# Altium project Ballast and Depth Controller.PrjPcb
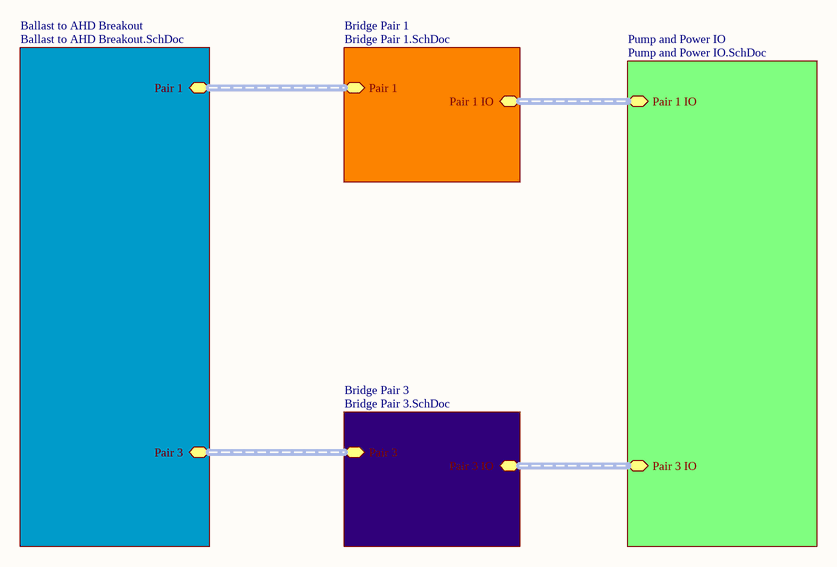
[diagram p0: Ballast and Depth Controller.SchDoc]
5 sheets, 103 parts. Net scope: hierarchical (ports join the sheet entries above them; power ports are global).
Board file: Ballast and Depth Controller.PcbDoc
Sheets:
  Ballast and Depth Controller.SchDoc
    Ballast to AHD Breakout = Ballast to AHD Breakout.SchDoc
    Bridge Pair 1 = Bridge Pair 1.SchDoc
    Pump and Power IO = Pump and Power IO.SchDoc
    Bridge Pair 3 = Bridge Pair 3.SchDoc

## Sheet Ballast and Depth Controller.SchDoc: Active Ballast Controller
size A; DrawnBy: Adam Vadala-Roth; DocumentNumber: 1; Revision: 2.1a; SheetNumber: 1; SheetTotal: 5

### Sub-sheets
Ballast to AHD Breakout = Ballast to AHD Breakout.SchDoc: Pair 1 (harness Pair_1_AHD), Pair 3 (harness Pair_3_AHD)
Bridge Pair 1 = Bridge Pair 1.SchDoc: Pair 1 (harness Pair_1_AHD), Pair 1 IO (harness Pair_1_IO)
Bridge Pair 3 = Bridge Pair 3.SchDoc: Pair 3 (harness Pair_3_AHD), Pair 3 IO (harness Pair_3_IO)
Pump and Power IO = Pump and Power IO.SchDoc: Pair 1 IO (harness Pair_1_IO), Pair 3 IO (harness Pair_3_IO)

### Buses and harness runs
harness sheet Ballast to AHD Breakout/Pair 1 = sheet Bridge Pair 1/Pair 1
harness sheet Ballast to AHD Breakout/Pair 3 = sheet Bridge Pair 3/Pair 3
harness sheet Bridge Pair 1/Pair 1 IO = sheet Pump and Power IO/Pair 1 IO
harness sheet Bridge Pair 3/Pair 3 IO = sheet Pump and Power IO/Pair 3 IO

## Sheet Ballast to AHD Breakout.SchDoc: Control Signal Breakout & Current Sesnsing
size A; DrawnBy: Adam Vadala-Roth; DocumentNumber: 2; Revision: 2.1a; SheetNumber: 2; SheetTotal: 5
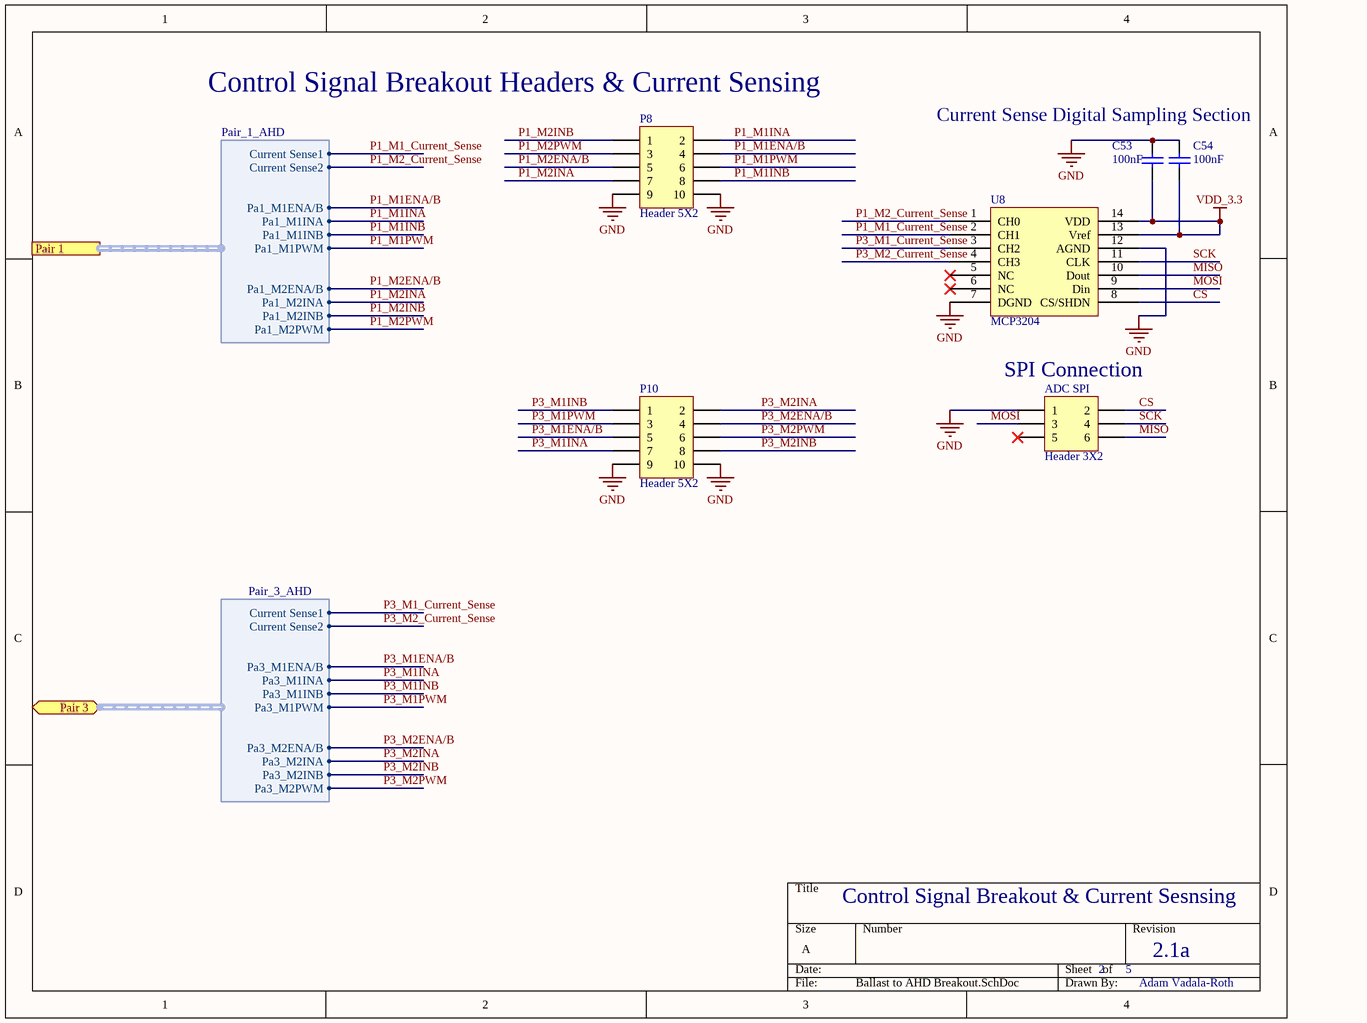
[diagram p1: Ballast to AHD Breakout.SchDoc]

### Parts
ADC_SPI  Header 3X2  [HDR2X3]
C53  value 100nF  [C1206]  (hidden comment: Cap Semi)
C54  value 100nF  [C1206]  (hidden comment: Cap Semi)
P8  Header 5X2  [HDR2X5]
P10  Header 5X2  [HDR2X5]
U8  MCP3204  [MCP3204]

### Ports
Pair 1 (harness Pair_1_AHD), Pair 3 (harness Pair_3_AHD)

### Harnesses
Pair_1_AHD: Current Sense1, Current Sense2, Pa1_M1ENA/B, Pa1_M1INA, Pa1_M1INB, Pa1_M1PWM, Pa1_M2INA, Pa1_M2ENA/B, Pa1_M2INB, Pa1_M2PWM
Pair_3_AHD: Current Sense1, Current Sense2, Pa3_M1ENA/B, Pa3_M1INA, Pa3_M1INB, Pa3_M1PWM, Pa3_M2INA, Pa3_M2ENA/B, Pa3_M2INB, Pa3_M2PWM

### Nets
GND: ADC_SPI.1 C53.2 C54.2 P8.9 P8.10 P10.9 P10.10 U8.7(DGND) U8.12(AGND)
VDD_3.3: C53.1 C54.1 U8.13(Vref) U8.14(VDD)
CS: ADC_SPI.2 U8.8(CS/SHDN)
MISO: ADC_SPI.6 U8.10(Dout)
MOSI: ADC_SPI.3 U8.9(Din)
P1_M1_Current_Sense: U8.2(CH1) ; port Pair 1.Current Sense1
P1_M1ENA/B: P8.4 ; port Pair 1.Pa1_M1ENA/B
P1_M1INA: P8.2 ; port Pair 1.Pa1_M1INA
P1_M1INB: P8.8 ; port Pair 1.Pa1_M1INB
P1_M1PWM: P8.6 ; port Pair 1.Pa1_M1PWM
P1_M2_Current_Sense: U8.1(CH0) ; port Pair 1.Current Sense2
P1_M2ENA/B: P8.5 ; port Pair 1.Pa1_M2ENA/B
P1_M2INA: P8.7 ; port Pair 1.Pa1_M2INA
P1_M2INB: P8.1 ; port Pair 1.Pa1_M2INB
P1_M2PWM: P8.3 ; port Pair 1.Pa1_M2PWM
P3_M1_Current_Sense: U8.3(CH2) ; port Pair 3.Current Sense1
P3_M1ENA/B: P10.5 ; port Pair 3.Pa3_M1ENA/B
P3_M1INA: P10.7 ; port Pair 3.Pa3_M1INA
P3_M1INB: P10.1 ; port Pair 3.Pa3_M1INB
P3_M1PWM: P10.3 ; port Pair 3.Pa3_M1PWM
P3_M2_Current_Sense: U8.4(CH3) ; port Pair 3.Current Sense2
P3_M2ENA/B: P10.4 ; port Pair 3.Pa3_M2ENA/B
P3_M2INA: P10.2 ; port Pair 3.Pa3_M2INA
P3_M2INB: P10.8 ; port Pair 3.Pa3_M2INB
P3_M2PWM: P10.6 ; port Pair 3.Pa3_M2PWM
SCK: ADC_SPI.4 U8.11(CLK)

Not connected (* = marked no-connect by the designer): ADC_SPI 5*; U8 5(NC)* 6(NC)*

### Notes on the sheet
- (near P8) Control Signal Breakout Headers & Current Sensing
- Current Sense Digital Sampling Section
- (near ADC_SPI) SPI Connection

### Library data of the parts
ADC_SPI = Header 3X2: Header, 3-Pin, Dual row; LatestRevisionDate: 17-Jul-2002; LatestRevisionNote: Re-released for DXP Platform.; Publisher: Altium Limited
C53 C54 = Cap Semi: Capacitor (Semiconductor SIM Model); Published: 8-Jun-2000; LatestRevisionDate: 29-May-2009; LatestRevisionNote: IPC-7351 Footprint Added.; PackageReference: C1206; Publisher: Altium Limited; PackageDescription: Chip Capacitor
P8 P10 = Header 5X2: Header, 5-Pin, Dual row; LatestRevisionDate: 17-Jul-2002; LatestRevisionNote: Re-released for DXP Platform.; Publisher: Altium Limited
U8 = MCP3204: MCP3204 ADC

## Sheet Bridge Pair 1.SchDoc: VNH5019 Pair 1
size B; DrawnBy: Adam Vadala-Roth; DocumentNumber: 5; Revision: 2.1a; SheetNumber: 5; SheetTotal: 5
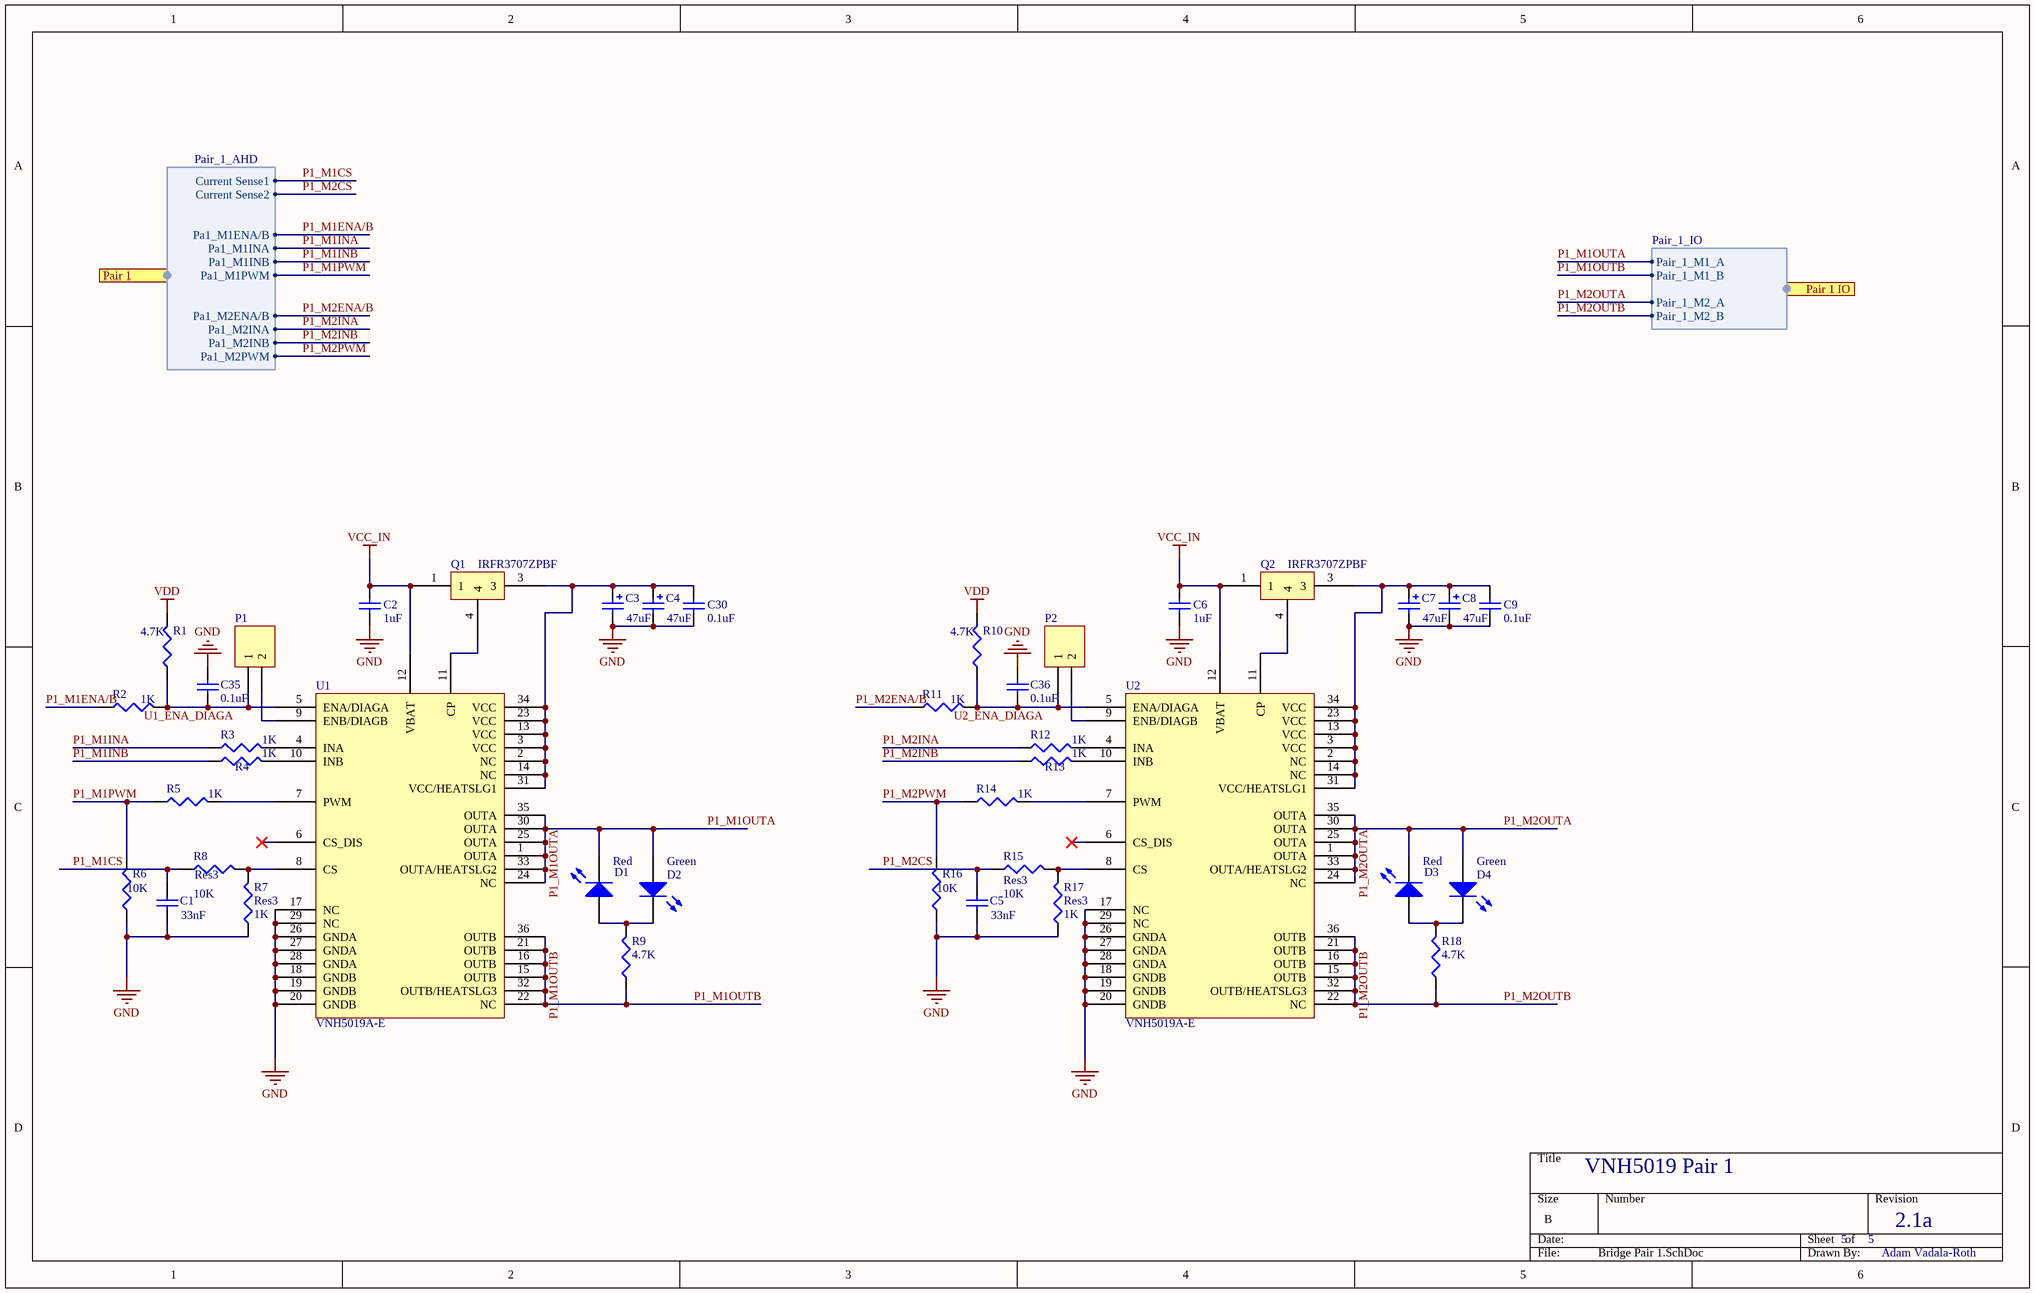
[diagram p2: Bridge Pair 1.SchDoc]

### Parts
C1  value 33nF  [1608[0603]]  (hidden comment: Cap Semi)
C2  value 1uF  [1608[0603]]  (hidden comment: Cap Semi)
C3  value 47uF  [CAPPR2-5x6.8]  (hidden comment: Cap Pol2)
C4  value 47uF  [CAPPR2-5x6.8]  (hidden comment: Cap Pol2)
C5  value 33nF  [1608[0603]]  (hidden comment: Cap Semi)
C6  value 1uF  [1608[0603]]  (hidden comment: Cap Semi)
C7  value 47uF  [CAPPR2-5x6.8]  (hidden comment: Cap Pol2)
C8  value 47uF  [CAPPR2-5x6.8]  (hidden comment: Cap Pol2)
C9  value 0.1uF  [C1206]  (hidden comment: Cap Semi)
C30  value 0.1uF  [C1206]  (hidden comment: Cap Semi)
C35  value 0.1uF  [1608[0603]]  (hidden comment: Cap Semi)
C36  value 0.1uF  [1608[0603]]  (hidden comment: Cap Semi)
D1  LED2  [3.2X1.6X1.1]  (value not drawn)
D2  LED2  [3.2X1.6X1.1]  (value not drawn)
D3  LED2  [3.2X1.6X1.1]  (value not drawn)
D4  LED2  [3.2X1.6X1.1]  (value not drawn)
P1  Header 2  [HDR1X2]  (value not drawn)
P2  Header 2  [HDR1X2]  (value not drawn)
Q1  IRFR3707ZPBF  [IRFR3707ZPBF]
Q2  IRFR3707ZPBF  [IRFR3707ZPBF]
R1  value 4.7K  [RESC1608L]  (hidden comment: Res3)
R2  value 1K  [RESC1608L]  (hidden comment: Res3)
R3  value 1K  [RESC1608L]  (hidden comment: Res3)
R4  value 1K  [RESC1608L]  (hidden comment: Res3)
R5  value 1K  [RESC1608L]  (hidden comment: Res3)
R6  value 10K  [RESC1608L]  (hidden comment: Res3)
R7  Res3  value 1K  [RESC1608L]
R8  Res3  value 10K  [RESC1608L]
R9  value 4.7K  [0805 SMD Resistor]  (hidden comment: Res3)
R10  value 4.7K  [RESC1608L]  (hidden comment: Res3)
R11  value 1K  [RESC1608L]  (hidden comment: Res3)
R12  value 1K  [RESC1608L]  (hidden comment: Res3)
R13  value 1K  [RESC1608L]  (hidden comment: Res3)
R14  value 1K  [RESC1608L]  (hidden comment: Res3)
R15  Res3  value 10K  [RESC1608L]
R16  value 10K  [RESC1608L]  (hidden comment: Res3)
R17  Res3  value 1K  [RESC1608L]
R18  value 4.7K  [0805 SMD Resistor]  (hidden comment: Res3)
U1  VNH5019A-E  [VNH5019A-E]
U2  VNH5019A-E  [VNH5019A-E]

### Ports
Pair 1 (harness Pair_1_AHD), Pair 1 IO (harness Pair_1_IO)

### Harnesses
Pair_1_IO: Pair_1_M1_A, Pair_1_M1_B, Pair_1_M2_A, Pair_1_M2_B
Pair_1_AHD: Current Sense1, Current Sense2, Pa1_M1ENA/B, Pa1_M1INA, Pa1_M1INB, Pa1_M1PWM, Pa1_M2INA, Pa1_M2ENA/B, Pa1_M2INB, Pa1_M2PWM

### Nets
GND: C1.1 C2.1 C3.2 C4.2 C5.1 C6.1 C7.2 C8.2 C9.1 C30.1 C35.1 C36.1 R6.1 R7.1 R16.1 R17.1 U1.17(NC) U1.18(GNDB) U1.19(GNDB) U1.20(GNDB) U1.26(GNDA) U1.27(GNDA) U1.28(GNDA) U1.29(NC) U2.17(NC) U2.18(GNDB) U2.19(GNDB) U2.20(GNDB) U2.26(GNDA) U2.27(GNDA) U2.28(GNDA) U2.29(NC)
VCC_IN: C2.2 C6.2 Q1.1 Q2.1 U1.12(VBAT) U2.12(VBAT)
VDD: R1.2 R10.2
P1_M1CS: C1.2 R8.1 ; port Pair 1.Current Sense1  [project net P1_M1_Current_Sense]
P1_M1ENA/B: R2.1 ; port Pair 1.Pa1_M1ENA/B
P1_M1INA: R3.1 ; port Pair 1.Pa1_M1INA
P1_M1INB: R4.1 ; port Pair 1.Pa1_M1INB
P1_M1OUTA: D1.2(K) D2.1(A) U1.1(OUTA) U1.24(NC) U1.25(OUTA) U1.30(OUTA) U1.33(OUTA/HEATSLG2) U1.35(OUTA) ; port Pair 1 IO.Pair_1_M1_A
P1_M1OUTB: R9.1 U1.15(OUTB) U1.16(OUTB) U1.21(OUTB) U1.22(NC) U1.32(OUTB/HEATSLG3) U1.36(OUTB) ; port Pair 1 IO.Pair_1_M1_B
P1_M1PWM: R5.1 R6.2 ; port Pair 1.Pa1_M1PWM
P1_M2CS: C5.2 R15.1 ; port Pair 1.Current Sense2  [project net P1_M2_Current_Sense]
P1_M2ENA/B: R11.1 ; port Pair 1.Pa1_M2ENA/B
P1_M2INA: R12.1 ; port Pair 1.Pa1_M2INA
P1_M2INB: R13.1 ; port Pair 1.Pa1_M2INB
P1_M2OUTA: D3.2(K) D4.1(A) U2.1(OUTA) U2.24(NC) U2.25(OUTA) U2.30(OUTA) U2.33(OUTA/HEATSLG2) U2.35(OUTA) ; port Pair 1 IO.Pair_1_M2_A
P1_M2OUTB: R18.1 U2.15(OUTB) U2.16(OUTB) U2.21(OUTB) U2.22(NC) U2.32(OUTB/HEATSLG3) U2.36(OUTB) ; port Pair 1 IO.Pair_1_M2_B
P1_M2PWM: R14.1 R16.2 ; port Pair 1.Pa1_M2PWM
U1_ENA_DIAGA: C35.2 P1.1 R1.1 R2.2 U1.5(ENA/DIAGA)
U2_ENA_DIAGA: C36.2 P2.1 R10.1 R11.2 U2.5(ENA/DIAGA)
NetC3_1: C3.1 C4.1 C30.2 Q1.3 U1.2(NC) U1.3(VCC) U1.13(VCC) U1.14(NC) U1.23(VCC) U1.31(VCC/HEATSLG1) U1.34(VCC)
NetC7_1: C7.1 C8.1 C9.2 Q2.3 U2.2(NC) U2.3(VCC) U2.13(VCC) U2.14(NC) U2.23(VCC) U2.31(VCC/HEATSLG1) U2.34(VCC)
NetD1_1: D1.1(A) D2.2(K) R9.2
NetD3_1: D3.1(A) D4.2(K) R18.2
NetP1_2: P1.2 U1.9(ENB/DIAGB)
NetP2_2: P2.2 U2.9(ENB/DIAGB)
NetQ1_4: Q1.4 U1.11(CP)
NetQ2_4: Q2.4 U2.11(CP)
NetR3_2: R3.2 U1.4(INA)
NetR4_2: R4.2 U1.10(INB)
NetR5_2: R5.2 U1.7(PWM)
NetR7_2: R7.2 R8.2 U1.8(CS)
NetR12_2: R12.2 U2.4(INA)
NetR13_2: R13.2 U2.10(INB)
NetR14_2: R14.2 U2.7(PWM)
NetR15_2: R15.2 R17.2 U2.8(CS)

Not connected (* = marked no-connect by the designer): U1 6(CS_DIS)*; U2 6(CS_DIS)*

### Notes on the sheet
- Red
- (near D2) Green
- (near D4) Green

### Library data of the parts
C1 C2 C5 C6 C9 C30 C35 C36 = Cap Semi: Capacitor (Semiconductor SIM Model); Published: 8-Jun-2000; LatestRevisionDate: 29-May-2009; LatestRevisionNote: IPC-7351 Footprint Added.; PackageReference: C1206; Publisher: Altium Limited; PackageDescription: Chip Capacitor
C3 C4 C7 C8 = Cap Pol2: Polarized Capacitor (Axial); Published: 8-Jun-2000; LatestRevisionDate: 17-Jul-2002; LatestRevisionNote: Re-released for DXP Platform.; PackageReference: POLAR0.8; Publisher: Altium Limited; PackageDescription: Polarized Capacitor; 2 Leads
D1-D4 = LED2: Typical RED, GREEN, YELLOW, AMBER GaAs LED; Published: 8-Jun-2000; LatestRevisionDate: 17-Jul-2002; LatestRevisionNote: Re-released for DXP Platform.; PackageVersion: Feb-2002; PackageReference: 3.2X1.6X1.1; Publisher: Altium Limited; PackageDescription: SM LED; 2 Flat Leads
P1 P2 = Header 2: Header, 2-Pin; LatestRevisionDate: 17-Jul-2002; LatestRevisionNote: Re-released for DXP Platform.; Publisher: Altium Limited
Q1 Q2 = IRFR3707ZPBF: Power FET
R1-R18 = Res3: Resistor; Published: 8-Jun-2000; LatestRevisionDate: 29-May-2009; LatestRevisionNote: IPC-7351 Footprint Added.; PackageReference: J1-0603; Publisher: Altium Limited; PackageDescription: Chip Resistor
U1 U2 = VNH5019A-E: VNH5019A-E H-Bridge

## Sheet Pump and Power IO.SchDoc: Actuator and Power Connection Terminals
size A; DrawnBy: Adam Vadala-Roth; DocumentNumber: 3; Revision: 2.1a; SheetNumber: 3; SheetTotal: 5
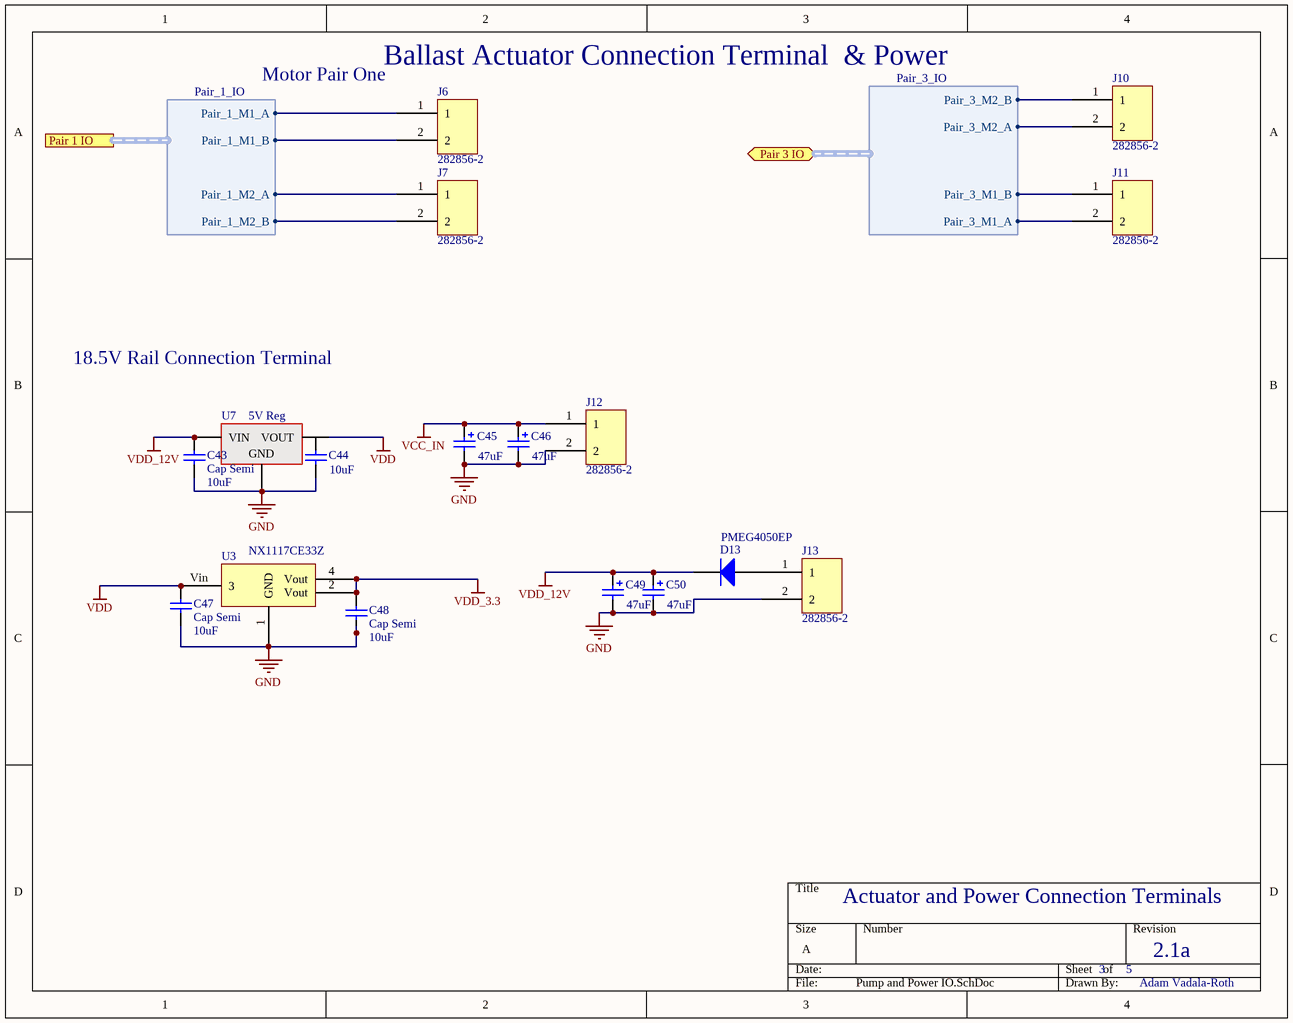
[diagram p3: Pump and Power IO.SchDoc]

### Parts
C43  Cap Semi  value 10uF  [C1206]
C44  value 10uF  [C1206]  (hidden comment: Cap Semi)
C45  value 47uF  [CAPPR2-5x6.8]  (hidden comment: Cap Pol2)
C46  value 47uF  [CAPPR2-5x6.8]  (hidden comment: Cap Pol2)
C47  Cap Semi  value 10uF  [C1206]
C48  Cap Semi  value 10uF  [C1206]
C49  value 47uF  [CAPPR2-5x6.8]  (hidden comment: Cap Pol2)
C50  value 47uF  [CAPPR2-5x6.8]  (hidden comment: Cap Pol2)
D13  PMEG4050EP  [PMEG4050EP]
J6  282856-2  [282856-2]
J7  282856-2  [282856-2]
J10  282856-2  [282856-2]
J11  282856-2  [282856-2]
J12  282856-2  [282856-2]
J13  282856-2  [282856-2]
U3  NX1117CE33Z  [NX1117CE33Z]
U7  5V Reg  [DPAK-3]

### Ports
Pair 1 IO (harness Pair_1_IO), Pair 3 IO (harness Pair_3_IO)

### Harnesses
Pair_1_IO: Pair_1_M1_A, Pair_1_M1_B, Pair_1_M2_A, Pair_1_M2_B
Pair_3_IO: Pair_3_M1_A, Pair_3_M1_B, Pair_3_M2_A, Pair_3_M2_B

### Nets
GND: C43.1 C44.1 C45.2 C46.2 C47.1 C48.1 C49.2 C50.2 J12.2 J13.2 U3.1(GND) U7.2(GND)
VCC_IN: C45.1 C46.1 J12.1
VDD: C47.2 U3.Vin(3) U7.3(VOUT)
VDD_3.3: C48.2 U3.2(Vout) U3.4(Vout)
VDD_12V: C43.2 C49.1 C50.1 D13.2(K) U7.1(VIN)
P1_M1OUTA: J6.1 ; port Pair 1 IO.Pair_1_M1_A
P1_M1OUTB: J6.2 ; port Pair 1 IO.Pair_1_M1_B
P1_M2OUTA: J7.1 ; port Pair 1 IO.Pair_1_M2_A
P1_M2OUTB: J7.2 ; port Pair 1 IO.Pair_1_M2_B
P3_M1OUTA: J11.2 ; port Pair 3 IO.Pair_3_M1_A
P3_M1OUTB: J11.1 ; port Pair 3 IO.Pair_3_M1_B
P3_M2OUTA: J10.2 ; port Pair 3 IO.Pair_3_M2_A
P3_M2OUTB: J10.1 ; port Pair 3 IO.Pair_3_M2_B
NetD13_1: D13.1(A) J13.1

Not connected (* = marked no-connect by the designer): C44 2

### Notes on the sheet
- (near J6) Motor Pair One
- (near J6) Ballast Actuator Connection Terminal  & Power
- 18.5V Rail Connection Terminal

### Library data of the parts
C43 C44 C47 C48 = Cap Semi: Capacitor (Semiconductor SIM Model); Published: 8-Jun-2000; LatestRevisionDate: 29-May-2009; LatestRevisionNote: IPC-7351 Footprint Added.; PackageReference: C1206; Publisher: Altium Limited; PackageDescription: Chip Capacitor
C45 C46 C49 C50 = Cap Pol2: Polarized Capacitor (Axial); Published: 8-Jun-2000; LatestRevisionDate: 17-Jul-2002; LatestRevisionNote: Re-released for DXP Platform.; PackageReference: POLAR0.8; Publisher: Altium Limited; PackageDescription: Polarized Capacitor; 2 Leads
D13 = Diode: Default Diode; Published: 8-Jun-2000; LatestRevisionDate: 17-Jul-2002; LatestRevisionNote: Re-released for DXP Platform.; PackageVersion: Sep-1996; PackageReference: SMC; Publisher: Altium Limited; PackageDescription: DO-214-AB/SMC; 2 C-Bend Leads; Body 7.9 x 5.9 mm, inc. leads (LxW); Code_JEDEC: DO-214-AB
J6 J7 J10-J13 = 282856-2: Two pole screw terminal
U3 = NX1117CE33Z: 3.3v Linear Regulator
U7 = VOLT REG: Voltage regulator; Published: 24-Mar-1999; LatestRevisionDate: 29-May-2009; LatestRevisionNote: IPC-7351 Footprint Added.; PackageReference: D2PAK; Publisher: Altium Limited; PackageDescription: 3-Pin Transistor Outline Package 2.54 mm Pitch, 15.1 mm Lead Span

## Sheet Bridge Pair 3.SchDoc: VNH5019 Pair 2
size B; DrawnBy: Adam Vadala-Roth; DocumentNumber: 4; Revision: 2.1a; SheetNumber: 4; SheetTotal: 5
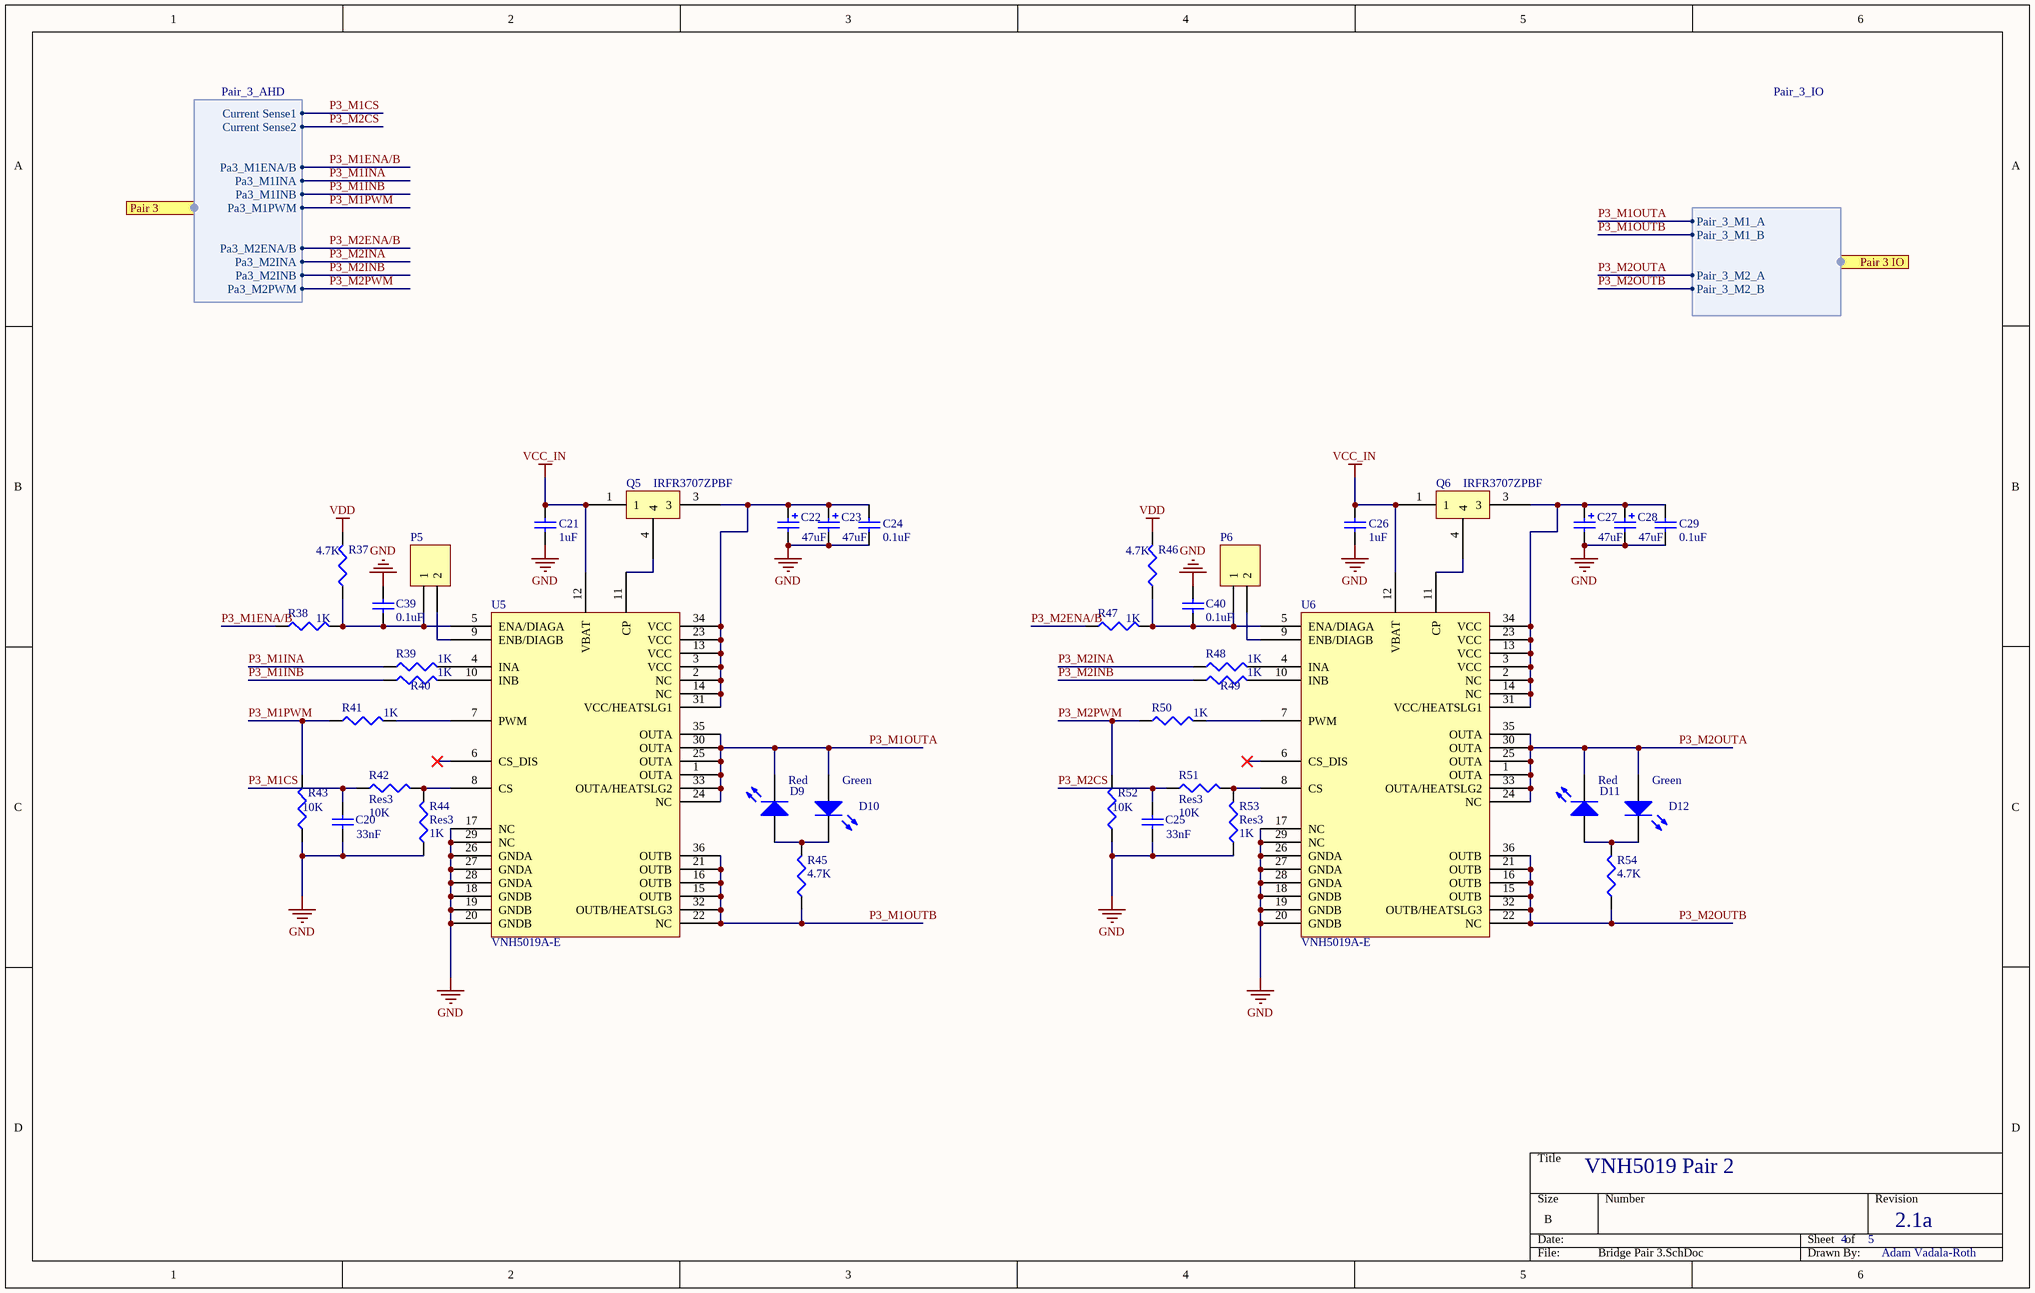
[diagram p4: Bridge Pair 3.SchDoc]

### Parts
C20  value 33nF  [1608[0603]]  (hidden comment: Cap Semi)
C21  value 1uF  [1608[0603]]  (hidden comment: Cap Semi)
C22  value 47uF  [CAPPR2-5x6.8]  (hidden comment: Cap Pol2)
C23  value 47uF  [CAPPR2-5x6.8]  (hidden comment: Cap Pol2)
C24  value 0.1uF  [C1206]  (hidden comment: Cap Semi)
C25  value 33nF  [1608[0603]]  (hidden comment: Cap Semi)
C26  value 1uF  [1608[0603]]  (hidden comment: Cap Semi)
C27  value 47uF  [CAPPR2-5x6.8]  (hidden comment: Cap Pol2)
C28  value 47uF  [CAPPR2-5x6.8]  (hidden comment: Cap Pol2)
C29  value 0.1uF  [C1206]  (hidden comment: Cap Semi)
C39  value 0.1uF  [1608[0603]]  (hidden comment: Cap Semi)
C40  value 0.1uF  [1608[0603]]  (hidden comment: Cap Semi)
D9  LED2  [3.2X1.6X1.1]  (value not drawn)
D10  LED2  [3.2X1.6X1.1]  (value not drawn)
D11  LED2  [3.2X1.6X1.1]  (value not drawn)
D12  LED2  [3.2X1.6X1.1]  (value not drawn)
P5  Header 2  [HDR1X2]  (value not drawn)
P6  Header 2  [HDR1X2]  (value not drawn)
Q5  IRFR3707ZPBF  [IRFR3707ZPBF]
Q6  IRFR3707ZPBF  [IRFR3707ZPBF]
R37  value 4.7K  [RESC1608L]  (hidden comment: Res3)
R38  value 1K  [RESC1608L]  (hidden comment: Res3)
R39  value 1K  [RESC1608L]  (hidden comment: Res3)
R40  value 1K  [RESC1608L]  (hidden comment: Res3)
R41  value 1K  [RESC1608L]  (hidden comment: Res3)
R42  Res3  value 10K  [RESC1608L]
R43  value 10K  [RESC1608L]  (hidden comment: Res3)
R44  Res3  value 1K  [RESC1608L]
R45  value 4.7K  [0805 SMD Resistor]  (hidden comment: Res3)
R46  value 4.7K  [RESC1608L]  (hidden comment: Res3)
R47  value 1K  [RESC1608L]  (hidden comment: Res3)
R48  value 1K  [RESC1608L]  (hidden comment: Res3)
R49  value 1K  [RESC1608L]  (hidden comment: Res3)
R50  value 1K  [RESC1608L]  (hidden comment: Res3)
R51  Res3  value 10K  [RESC1608L]
R52  value 10K  [RESC1608L]  (hidden comment: Res3)
R53  Res3  value 1K  [RESC1608L]
R54  value 4.7K  [0805 SMD Resistor]  (hidden comment: Res3)
U5  VNH5019A-E  [VNH5019A-E]
U6  VNH5019A-E  [VNH5019A-E]

### Ports
Pair 3 (harness Pair_3_AHD), Pair 3 IO (harness Pair_3_IO)

### Harnesses
Pair_3_IO: Pair_3_M1_A, Pair_3_M1_B, Pair_3_M2_A, Pair_3_M2_B
Pair_3_AHD: Current Sense1, Current Sense2, Pa3_M1ENA/B, Pa3_M1INA, Pa3_M1INB, Pa3_M1PWM, Pa3_M2INA, Pa3_M2ENA/B, Pa3_M2INB, Pa3_M2PWM

### Nets
GND: C20.1 C21.1 C22.2 C23.2 C24.1 C25.1 C26.1 C27.2 C28.2 C29.1 C39.1 C40.1 R43.1 R44.1 R52.1 R53.1 U5.17(NC) U5.18(GNDB) U5.19(GNDB) U5.20(GNDB) U5.26(GNDA) U5.27(GNDA) U5.28(GNDA) U5.29(NC) U6.17(NC) U6.18(GNDB) U6.19(GNDB) U6.20(GNDB) U6.26(GNDA) U6.27(GNDA) U6.28(GNDA) U6.29(NC)
VCC_IN: C21.2 C26.2 Q5.1 Q6.1 U5.12(VBAT) U6.12(VBAT)
VDD: R37.2 R46.2
P3_M1CS: C20.2 R42.1 ; port Pair 3.Current Sense1  [project net P3_M1_Current_Sense]
P3_M1ENA/B: R38.1 ; port Pair 3.Pa3_M1ENA/B
P3_M1INA: R39.1 ; port Pair 3.Pa3_M1INA
P3_M1INB: R40.1 ; port Pair 3.Pa3_M1INB
P3_M1OUTA: D9.2(K) D10.1(A) U5.1(OUTA) U5.24(NC) U5.25(OUTA) U5.30(OUTA) U5.33(OUTA/HEATSLG2) U5.35(OUTA) ; port Pair 3 IO.Pair_3_M1_A
P3_M1OUTB: R45.1 U5.15(OUTB) U5.16(OUTB) U5.21(OUTB) U5.22(NC) U5.32(OUTB/HEATSLG3) U5.36(OUTB) ; port Pair 3 IO.Pair_3_M1_B
P3_M1PWM: R41.1 R43.2 ; port Pair 3.Pa3_M1PWM
P3_M2CS: C25.2 R51.1 ; port Pair 3.Current Sense2  [project net P3_M2_Current_Sense]
P3_M2ENA/B: R47.1 ; port Pair 3.Pa3_M2ENA/B
P3_M2INA: R48.1 ; port Pair 3.Pa3_M2INA
P3_M2INB: R49.1 ; port Pair 3.Pa3_M2INB
P3_M2OUTA: D11.2(K) D12.1(A) U6.1(OUTA) U6.24(NC) U6.25(OUTA) U6.30(OUTA) U6.33(OUTA/HEATSLG2) U6.35(OUTA) ; port Pair 3 IO.Pair_3_M2_A
P3_M2OUTB: R54.1 U6.15(OUTB) U6.16(OUTB) U6.21(OUTB) U6.22(NC) U6.32(OUTB/HEATSLG3) U6.36(OUTB) ; port Pair 3 IO.Pair_3_M2_B
P3_M2PWM: R50.1 R52.2 ; port Pair 3.Pa3_M2PWM
NetC22_1: C22.1 C23.1 C24.2 Q5.3 U5.2(NC) U5.3(VCC) U5.13(VCC) U5.14(NC) U5.23(VCC) U5.31(VCC/HEATSLG1) U5.34(VCC)
NetC27_1: C27.1 C28.1 C29.2 Q6.3 U6.2(NC) U6.3(VCC) U6.13(VCC) U6.14(NC) U6.23(VCC) U6.31(VCC/HEATSLG1) U6.34(VCC)
NetC39_2: C39.2 P5.1 R37.1 R38.2 U5.5(ENA/DIAGA)
NetC40_2: C40.2 P6.1 R46.1 R47.2 U6.5(ENA/DIAGA)
NetD9_1: D9.1(A) D10.2(K) R45.2
NetD11_1: D11.1(A) D12.2(K) R54.2
NetP5_2: P5.2 U5.9(ENB/DIAGB)
NetP6_2: P6.2 U6.9(ENB/DIAGB)
NetQ5_4: Q5.4 U5.11(CP)
NetQ6_4: Q6.4 U6.11(CP)
NetR39_2: R39.2 U5.4(INA)
NetR40_2: R40.2 U5.10(INB)
NetR41_2: R41.2 U5.7(PWM)
NetR42_2: R42.2 R44.2 U5.8(CS)
NetR48_2: R48.2 U6.4(INA)
NetR49_2: R49.2 U6.10(INB)
NetR50_2: R50.2 U6.7(PWM)
NetR51_2: R51.2 R53.2 U6.8(CS)

Not connected (* = marked no-connect by the designer): U5 6(CS_DIS)*; U6 6(CS_DIS)*

### Notes on the sheet
- Red
- (near D10) Green
- (near D12) Green

### Library data of the parts
C20 C21 C24-C26 C29 C39 C40 = Cap Semi: Capacitor (Semiconductor SIM Model); Published: 8-Jun-2000; LatestRevisionDate: 29-May-2009; LatestRevisionNote: IPC-7351 Footprint Added.; PackageReference: C1206; Publisher: Altium Limited; PackageDescription: Chip Capacitor
C22 C23 C27 C28 = Cap Pol2: Polarized Capacitor (Axial); Published: 8-Jun-2000; LatestRevisionDate: 17-Jul-2002; LatestRevisionNote: Re-released for DXP Platform.; PackageReference: POLAR0.8; Publisher: Altium Limited; PackageDescription: Polarized Capacitor; 2 Leads
D9-D12 = LED2: as D1 on sheet Bridge Pair 1; Published: 8-Jun-2000; LatestRevisionDate: 17-Jul-2002; LatestRevisionNote: Re-released for DXP Platform.; PackageVersion: Feb-2002; PackageReference: 3.2X1.6X1.1; Publisher: Altium Limited; PackageDescription: SM LED; 2 Flat Leads
P5 P6 = Header 2: Header, 2-Pin; LatestRevisionDate: 17-Jul-2002; LatestRevisionNote: Re-released for DXP Platform.; Publisher: Altium Limited
Q5 Q6 = IRFR3707ZPBF: Power FET
R37-R54 = Res3: Resistor; Published: 8-Jun-2000; LatestRevisionDate: 29-May-2009; LatestRevisionNote: IPC-7351 Footprint Added.; PackageReference: J1-0603; Publisher: Altium Limited; PackageDescription: Chip Resistor
U5 U6 = VNH5019A-E: VNH5019A-E H-Bridge

## Nets that join several sheets
GND: Ballast to AHD Breakout (9 pins), Bridge Pair 1 (32 pins), Pump and Power IO (12 pins), Bridge Pair 3 (32 pins)
VCC_IN: Bridge Pair 1 (6 pins), Pump and Power IO (C45.1 C46.1 J12.1), Bridge Pair 3 (6 pins)
VDD: Bridge Pair 1 (R1.2 R10.2), Pump and Power IO (C47.2 U3.Vin U7.3), Bridge Pair 3 (R37.2 R46.2)
VDD_3.3: Ballast to AHD Breakout (C53.1 C54.1 U8.13 U8.14), Pump and Power IO (C48.2 U3.2 U3.4)
P1_M1_Current_Sense: Ballast to AHD Breakout (U8.2), Bridge Pair 1 (C1.2 R8.1)
P1_M1ENA/B: Ballast to AHD Breakout (P8.4), Bridge Pair 1 (R2.1)
P1_M1INA: Ballast to AHD Breakout (P8.2), Bridge Pair 1 (R3.1)
P1_M1INB: Ballast to AHD Breakout (P8.8), Bridge Pair 1 (R4.1)
P1_M1OUTA: Bridge Pair 1 (8 pins), Pump and Power IO (J6.1)
P1_M1OUTB: Bridge Pair 1 (7 pins), Pump and Power IO (J6.2)
P1_M1PWM: Ballast to AHD Breakout (P8.6), Bridge Pair 1 (R5.1 R6.2)
P1_M2_Current_Sense: Ballast to AHD Breakout (U8.1), Bridge Pair 1 (C5.2 R15.1)
P1_M2ENA/B: Ballast to AHD Breakout (P8.5), Bridge Pair 1 (R11.1)
P1_M2INA: Ballast to AHD Breakout (P8.7), Bridge Pair 1 (R12.1)
P1_M2INB: Ballast to AHD Breakout (P8.1), Bridge Pair 1 (R13.1)
P1_M2OUTA: Bridge Pair 1 (8 pins), Pump and Power IO (J7.1)
P1_M2OUTB: Bridge Pair 1 (7 pins), Pump and Power IO (J7.2)
P1_M2PWM: Ballast to AHD Breakout (P8.3), Bridge Pair 1 (R14.1 R16.2)
P3_M1_Current_Sense: Ballast to AHD Breakout (U8.3), Bridge Pair 3 (C20.2 R42.1)
P3_M1ENA/B: Ballast to AHD Breakout (P10.5), Bridge Pair 3 (R38.1)
P3_M1INA: Ballast to AHD Breakout (P10.7), Bridge Pair 3 (R39.1)
P3_M1INB: Ballast to AHD Breakout (P10.1), Bridge Pair 3 (R40.1)
P3_M1OUTA: Pump and Power IO (J11.2), Bridge Pair 3 (8 pins)
P3_M1OUTB: Pump and Power IO (J11.1), Bridge Pair 3 (7 pins)
P3_M1PWM: Ballast to AHD Breakout (P10.3), Bridge Pair 3 (R41.1 R43.2)
P3_M2_Current_Sense: Ballast to AHD Breakout (U8.4), Bridge Pair 3 (C25.2 R51.1)
P3_M2ENA/B: Ballast to AHD Breakout (P10.4), Bridge Pair 3 (R47.1)
P3_M2INA: Ballast to AHD Breakout (P10.2), Bridge Pair 3 (R48.1)
P3_M2INB: Ballast to AHD Breakout (P10.8), Bridge Pair 3 (R49.1)
P3_M2OUTA: Pump and Power IO (J10.2), Bridge Pair 3 (8 pins)
P3_M2OUTB: Pump and Power IO (J10.1), Bridge Pair 3 (7 pins)
P3_M2PWM: Ballast to AHD Breakout (P10.6), Bridge Pair 3 (R50.1 R52.2)